# Altium schematic sheet main-12.schdoc
size A3; SheetNumber: 2; SheetTotal: 2
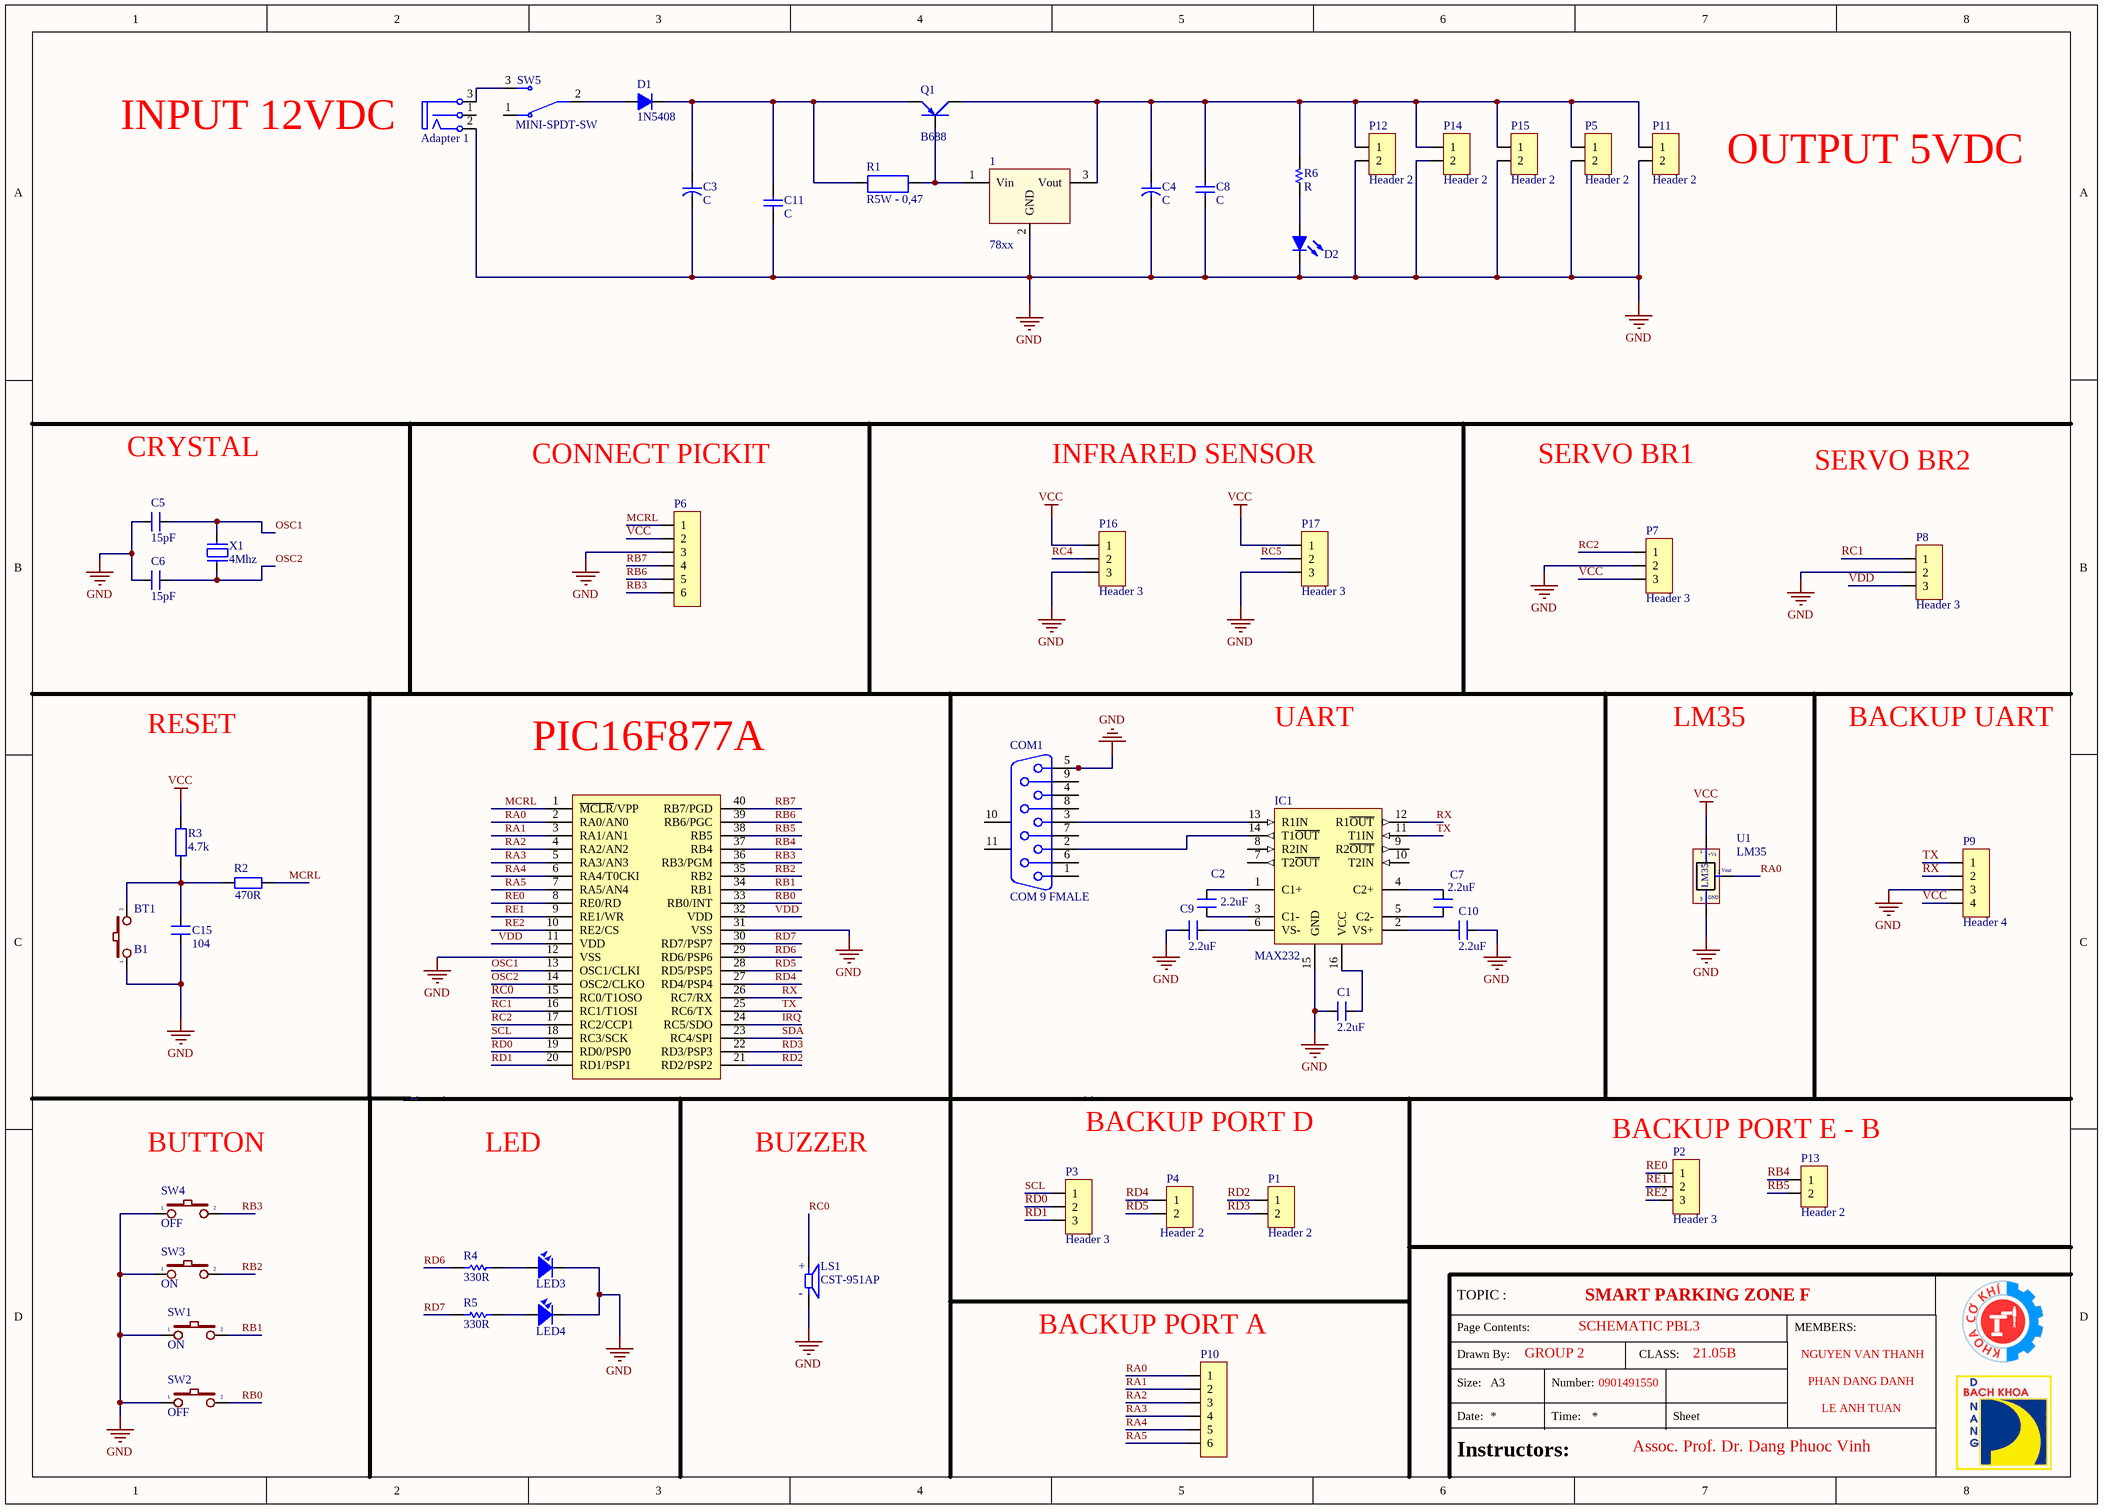
[diagram p0: main-12.schdoc]

## Parts
1  78xx  [TO-220]
Adapter_1  CON DC PWR  [CONN/DC/PWR/5.0MM]  (value not drawn)
BT1  B1  [SW2]
C1  2.2uF  [CN1]
C2  2.2uF  [CN1]
C3  C  [CYL/D.400/LS.200]
C4  C  [CYL/D.400/LS.200]
C5  15pF  [CN1]
C6  15pF  [CN1]
C7  2.2uF  [CN1]
C8  C  [CAP Ceramic/W300]
C9  2.2uF  [CN1]
C10  2.2uF  [CN1]
C11  C  [CAP Ceramic/W300]
C15  104  [CN1]
COM1  COM 9 FMALE  [DSB 9-F]
D1  1N5408  [D5A]
D2  Led  [LED 5MM - RED]  (value not drawn)
IC1  MAX232  [DIP16/W0.3]
LED3  LED  [LED-3]  (value not drawn)
LED4  LED  [LED-3]  (value not drawn)
LS1  CST-951AP  [CUI_CST-951AP]
P1  Header 2  [HDR/Header/2]
P2  Header 3  [HDR/Header/3/c1]
P3  Header 3  [HDR/Header/3/c1]
P4  Header 2  [HDR/Header/2]
P5  Header 2  [HDR/Terminal/2/5mm]
P6  Header 6  [HDR/Header/6]  (value not drawn)
P7  Header 3  [HDR/Terminal/3]
P8  Header 3  [HDR/Terminal/3]
P9  Header 4  [HDR/Header/4]
P10  Header 6  [HDR/Header/6]  (value not drawn)
P11  Header 2  [HDR/Terminal/2/5mm]
P12  Header 2  [HDR/Terminal/2/5mm]
P13  Header 2  [HDR/Header/2]
P14  Header 2  [HDR/Terminal/2/5mm]
P15  Header 2  [HDR/Terminal/2/5mm]
P16  Header 3  [HDR/Header/3/c1]
P17  Header 3  [HDR/Header/3/c1]
PIC16F877A  (no value)  [DIP40/W0.6]
Q1  B688  [QTO-220]
R1  R5W - 0,47  [R5W]
R2  470R  [R1/4W]
R3  4.7k  [R1/4W]
R4  value 330R  [R1/4W]  (hidden comment: Res1)
R5  value 330R  [R1/4W]  (hidden comment: Res1)
R6  R  [R 1/4W/300]
SW1  ON  [SW2]
SW2  OFF  [SW2]
SW3  ON  [SW2]
SW4  OFF  [SW2]
SW5  MINI-SPDT-SW  [SW_MINI-SPDT-SW]
U1  LM35  [QTO-92]
X1  4Mhz  [XT2]

## Nets
GND: 1.2(GND) Adapter_1.2(T) BT1.1 C1.2 C3.2 C4.2 C5.2 C6.2 C8.2 C9.2 C10.1 C11.2 C15.1 COM1.5 D2.2(K) IC1.15(GND) LED3.2 LED4.2 LS1.M P5.2 P6.3 P7.2 P8.2 P9.3 P11.2 P12.2 P14.2 P15.2 P16.3 P17.3 PIC16F877A.12(VSS) PIC16F877A.31(VSS) SW1.1 SW2.1 SW3.1 SW4.1 U1.3(-)
VCC: P6.2 P7.3 P9.4 P16.1 P17.1 R3.2 U1.1(+Vs)
IRQ: PIC16F877A.24(RC5/SDO)
MCRL: P6.1 PIC16F877A.1(~{MCLR}/VPP) R2.1
OSC1: C5.1 PIC16F877A.13(OSC1/CLKI) X1.2
OSC2: C6.1 PIC16F877A.14(OSC2/CLKO) X1.1
RA0: P10.1 PIC16F877A.2(RA0/AN0) U1.2(Vout)
RA1: P10.2 PIC16F877A.3(RA1/AN1)
RA2: P10.3 PIC16F877A.4(RA2/AN2)
RA3: P10.4 PIC16F877A.5(RA3/AN3)
RA4: P10.5 PIC16F877A.6(RA4/T0CKI)
RA5: P10.6 PIC16F877A.7(RA5/AN4)
RB0: PIC16F877A.33(RB0/INT) SW2.2
RB1: PIC16F877A.34(RB1) SW1.2
RB2: PIC16F877A.35(RB2) SW3.2
RB3: P6.6 PIC16F877A.36(RB3/PGM) SW4.2
RB4: P13.1 PIC16F877A.37(RB4)
RB5: P13.2 PIC16F877A.38(RB5)
RB6: P6.5 PIC16F877A.39(RB6/PGC)
RB7: P6.4 PIC16F877A.40(RB7/PGD)
RC0: LS1.P PIC16F877A.15(RC0/T1OSO)
RC1: P8.1 PIC16F877A.16(RC1/T1OSI)
RC2: P7.1 PIC16F877A.17(RC2/CCP1)
RC4: P16.2
RC5: P17.2
RD0: P3.2 PIC16F877A.19(RD0/PSP0)
RD1: P3.3 PIC16F877A.20(RD1/PSP1)
RD2: P1.1 PIC16F877A.21(RD2/PSP2)
RD3: P1.2 PIC16F877A.22(RD3/PSP3)
RD4: P4.1 PIC16F877A.27(RD4/PSP4)
RD5: P4.2 PIC16F877A.28(RD5/PSP5)
RD6: PIC16F877A.29(RD6/PSP6) R4.2
RD7: PIC16F877A.30(RD7/PSP7) R5.2
RE0: P2.1 PIC16F877A.8(RE0/RD)
RE1: P2.2 PIC16F877A.9(RE1/WR)
RE2: P2.3 PIC16F877A.10(RE2/CS)
RX: IC1.12(R1~{OUT}) P9.2 PIC16F877A.26(RC7/RX)
SCL: P3.1 PIC16F877A.18(RC3/SCK)
SDA: PIC16F877A.23(RC4/SPI)
TX: IC1.11(T1IN) P9.1 PIC16F877A.25(RC6/TX)
VDD: P8.3 PIC16F877A.11(VDD) PIC16F877A.32(VDD)
Net1_1: 1.1(Vin) Q1.1(B) R1.2
Net1_3: 1.3(Vout) C4.1 C8.1 P5.1 P11.1 P12.1 P14.1 P15.1 Q1.2(C) R6.2
NetAdapter_1_3: Adapter_1.3(TN) SW5.3
NetBT1_2: BT1.2 C15.2 R2.2 R3.1
NetC1_1: C1.1 IC1.16(VCC)
NetC2_1: C2.1 IC1.3(C1-)
NetC2_2: C2.2 IC1.1(C1+)
NetC3_1: C3.1 C11.1 D1.2(K) Q1.3(E) R1.1
NetC7_1: C7.1 IC1.5(C2-)
NetC7_2: C7.2 IC1.4(C2+)
NetC9_1: C9.1 IC1.6(VS-)
NetC10_2: C10.2 IC1.2(VS+)
NetCOM1_2: COM1.2 IC1.14(T1~{OUT})
NetCOM1_3: COM1.3 IC1.13(R1IN)
NetD1_1: D1.1(A) SW5.2
NetD2_1: D2.1(A) R6.1
NetLED3_1: LED3.1 R4.1
NetLED4_1: LED4.1 R5.1

Not connected (* = marked no-connect by the designer): Adapter_1 1(S); COM1 1 4 6 7 8 9 10(MH1) 11(MH2); IC1 7(T2~{OUT}) 8(R2IN) 9(R2~{OUT}) 10(T2IN); SW5 1

## Notes on the sheet
- INPUT 12VDC
- OUTPUT 5VDC
- CRYSTAL
- CONNECT PICKIT
- INFRARED SENSOR
- SERVO BR1
- SERVO BR2
- RESET
- UART
- LM35
- BACKUP UART
- BUTTON
- LED
- BUZZER
- BACKUP PORT D
- BACKUP PORT E - B
- (near P10) BACKUP PORT A
- TOPIC :
- SMART PARKING ZONE F
- Size:
- Drawn By:
- Page Contents:
- A3
- GROUP 2
- Number:
- SCHEMATIC PBL3
- 0901491550
- CLASS:
- 21.05B
- MEMBERS:
- NGUYEN VAN THANH
- PHAN DANG DANH
- Date:
- Instructors:
- Time:
- Assoc. Prof. Dr. Dang Phuoc Vinh
- Sheet
- LE ANH TUAN
- (in symbol CST-951AP) +; -
- (in symbol LM35) GND

## Library data of the parts
1 = 78xx: LDO Fixed Voltage regulator
Adapter_1 = CON DC PWR: DC input connector
BT1 SW1-SW4 = SW2: Switch button 2 pin; Value: SW chip 2 pin
C1 C2 C5-C7 C9 C10 = CN1: Cap np  1pF - 472pF; Value: 100pF
C3 C4 = Capacitor: Capacitor pol
C8 C11 = Capacitor NP: Capacitor non-pol
C15 = CN0: Cremic For Xtal 1pF => 100pF; Value: 33pF
COM1 = DSB9F: COM 9; PackageDocument: O; Positions: 9; Gender: Receptacle; Value: COM 9; Published: 15-Jun-2001; LatestRevisionDate: 17-Jul-2002; LatestRevisionNote: Re-released for DXP Platform.; DatasheetDocument: 1-Sep-1999; PackageReference: 788750; Publisher: Altium Limited; Orientation: Right Angle
D1 = D5A: Diode 5A; Value: 1N5408
D2 = Led: Typical LED
IC1 = MAX232: Dual EIA-232 Driver/Receiver; Value: MAX232
LED3 LED4 = LED: LED Single colour Green and Red; Value: LED 3 ly Single Colour
LS1 = CST-951AP: 9 mm, 5 V, 85 dB, Through Hole, Magnetic Audio Transducer Buzzer; Availability: Unavailable; Price: None; Value: *; MP: CST-951AP; Package: None
P1 P4 P5 P11-P15 = Header 2: Header, 2-Pin
P2 P3 P7 P8 P16 P17 = Header 3: Header, 3-Pin
P6 P10 = Header 6: Header, 6-Pin
P9 = Header 4: Header, 4-Pin
PIC16F877A = 16F877: 8K FLASH, 368B RAM, 256B EFROM; Value: PIC16F877A; Value: DIP 40; Copyright by: VanDungEvn
Q1 = PNP_BCE: P 1W, EBC; Value: TIP42
R1 = R5W: Resistor 5W; Value: R5W - 0,47R
R2 R3 = R1/4W: Resistor 1/4W; Value: R1/4W - 1K
R4 R5 = Res1_1: Resistor; Manufacturer: Generic Components; Class: Passive; Published: 08/06/2000; Publisher: Altium Hobart Technology Centre; SubClass: Resistor
R6 = Resistor
SW5 = MINI-SPDT-SW: Simple breadboard friendly SPDT slide switch. Rated at 30V/200mA with operating force of 250 +/-100gf.; Availability: Unavailable; Package: None; MP: MINI-SPDT-SW; Value: *; Price: None
U1 = LM35: Teminal; Value: LM35
X1 = XT2: Crystal For all Crystal 2pin.; Value: 4Mhz